# EAGLE schematic C717469 (EAGLE 9.6.2)
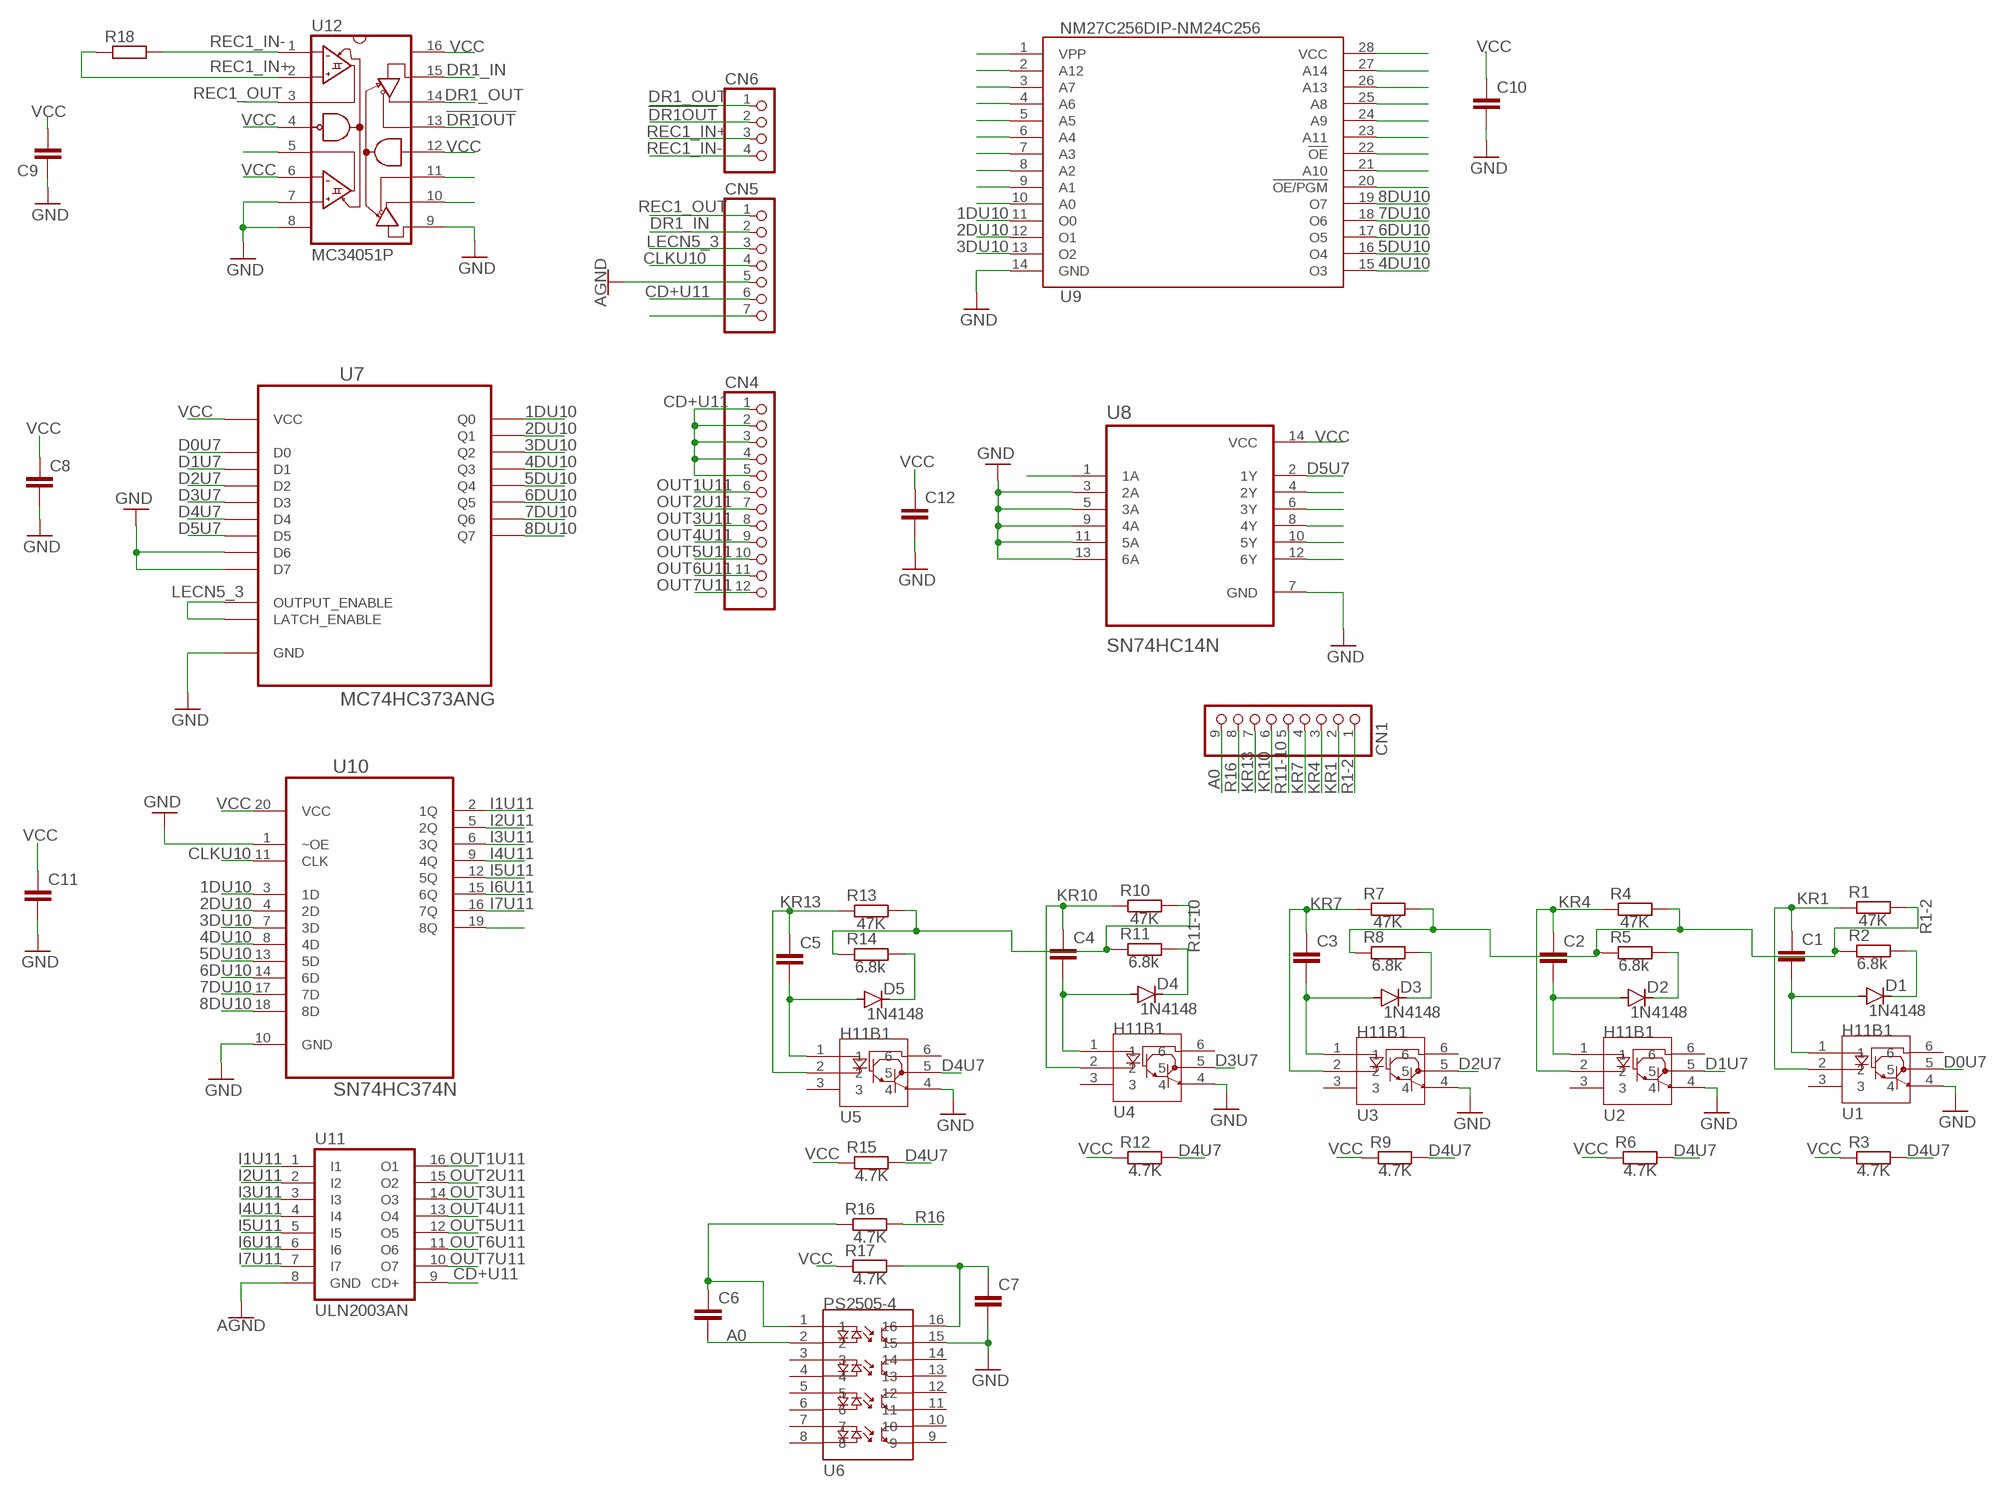
[diagram p0: schematic, sheet 1]

## Parts
C1  C-EU025-025X050  [C025-025X050]
C2  C-EU025-025X050  [C025-025X050]
C3  C-EU025-025X050  [C025-025X050]
C4  C-EU025-025X050  [C025-025X050]
C5  C-EU025-025X050  [C025-025X050]
C6  C-EU025-025X050  [C025-025X050]
C7  C-EU025-025X050  [C025-025X050]
C8  C-EU025-025X050  [C025-025X050]
C9  C-EU025-025X050  [C025-025X050]
C10  C-EU025-025X050  [C025-025X050]
C11  C-EU025-025X050  [C025-025X050]
C12  C-EU025-025X050  [C025-025X050]
CN1  PINHD-1X9  [1X09]
CN4  PINHD-1X12  [1X12]
CN5  PINHD-1X7  [1X07]
CN6  PINHD-1X4  [1X04]
D1  1N4148  1N4148DO35-10  [DO35-10]
D2  1N4148  1N4148DO35-10  [DO35-10]
D3  1N4148  1N4148DO35-10  [DO35-10]
D4  1N4148  1N4148DO35-10  [DO35-10]
D5  1N4148  1N4148DO35-10  [DO35-10]
R1  47K  R-EU_0207/10  [0207/10]
R2  6.8k  R-EU_0207/10  [0207/10]
R3  4.7K  R-EU_0207/10  [0207/10]
R4  47K  R-EU_0207/10  [0207/10]
R5  6.8k  R-EU_0207/10  [0207/10]
R6  4.7K  R-EU_0207/10  [0207/10]
R7  47K  R-EU_0207/10  [0207/10]
R8  6.8k  R-EU_0207/10  [0207/10]
R9  4.7K  R-EU_0207/10  [0207/10]
R10  47K  R-EU_0207/10  [0207/10]
R11  6.8k  R-EU_0207/10  [0207/10]
R12  4.7K  R-EU_0207/10  [0207/10]
R13  47K  R-EU_0207/10  [0207/10]
R14  6.8k  R-EU_0207/10  [0207/10]
R15  4.7K  R-EU_0207/10  [0207/10]
R16  4.7K  R-EU_0207/10  [0207/10]
R17  4.7K  R-EU_0207/10  [0207/10]
R18  R-EU_0207/10  [0207/10]
U1  H11B1  H11B1DIP6  [DIP762W50P254L730H410Q6]
U2  H11B1  H11B1DIP6  [DIP762W50P254L730H410Q6]
U3  H11B1  H11B1DIP6  [DIP762W50P254L730H410Q6]
U4  H11B1  H11B1DIP6  [DIP762W50P254L730H410Q6]
U5  H11B1  H11B1DIP6  [DIP762W50P254L730H410Q6]
U6  PS2505-4  [D16-L]
U7  MC74HC373ANG  [DIP254P762X457-20]
U8  SN74HC14N  [DIP794W45P254L1969H508Q14]
U9  NM27C256DIP-NM24C256  [DIP1499W48P254L3734H572Q28]
U10  SN74HC374N  [DIP254P762X508-20]
U11  ULN2003AN  [DIL16]
U12  MC34051P  [D16]

## Nets
1DU10: U7.2(Q0) U9.11(O0) U10.3(1D)
2DU10: U7.5(Q1) U9.12(O1) U10.4(2D)
3DU10: U7.6(Q2) U9.13(O2) U10.7(3D)
4DU10: U7.9(Q3) U9.15(O3) U10.8(4D)
5DU10: U7.12(Q4) U9.16(O4) U10.13(5D)
6DU10: U7.15(Q5) U9.17(O5) U10.14(6D)
7DU10: U7.16(Q6) U9.18(O6) U10.17(7D)
8DU10: U7.19(Q7) U9.19(O7) U10.18(8D)
!DR1OUT: CN6.2 U12.13(!DR1OUT)
A0: C6.2 CN1.9 U6.2
AGND: CN5.5 U11.8(GND)
CD+U11: CN4.1 CN4.2 CN4.3 CN4.4 CN4.5 CN5.6 U11.9(CD+)
CLKU10: CN5.4 U10.11(CLK)
D0U7: U1.5 U7.3(D0)
D1U7: U2.5 U7.4(D1)
D2U7: U3.5 U7.7(D2)
D3U7: U4.5 U7.8(D3)
D4U7: R3.2 R6.2 R9.2 R12.2 R15.2 U5.5 U7.13(D4)
D5U7: U7.14(D5) U8.2(1Y)
DR1_IN: CN5.2 U12.15(DR1IN)
DR1_OUT: CN6.1 U12.14(DR1OUT)
GND: C7.2 C8.2 C9.1 C10.2 C11.2 C12.2 U1.4 U2.4 U3.4 U4.4 U5.4 U6.15 U7.10(GND) U7.17(D6) U7.18(D7) U8.3(2A) U8.5(3A) U8.7(GND) U8.9(4A) U8.11(5A) U8.13(6A) U9.14(GND) U10.1(~OE) U10.10(GND) U12.7(REC2-IN) U12.8(GND) U12.9(DR2IN)
I1U11: U10.2(1Q) U11.1(I1)
I2U11: U10.5(2Q) U11.2(I2)
I3U11: U10.6(3Q) U11.3(I3)
I4U11: U10.9(4Q) U11.4(I4)
I5U11: U10.12(5Q) U11.5(I5)
I6U11: U10.15(6Q) U11.6(I6)
I7U11: U10.16(7Q) U11.7(I7)
KR1: C1.1 CN1.2 R1.1 U1.2
KR4: C2.1 CN1.3 R4.1 U2.2
KR7: C3.1 CN1.4 R7.1 U3.2
KR10: C4.1 CN1.6 R10.1 U4.2
KR13: C5.1 CN1.7 R13.1 U5.2
LECN5_3: CN5.3 U7.1(OUTPUT_ENABLE) U7.11(LATCH_ENABLE)
N$1: U12.10(DR2OUT)
N$2: U8.1(1A)
N$3: D5.C R14.2
N$4: U12.5(REC2OUT)
N$5: D3.C R8.2
N$6: U12.11(!DR2OUT)
N$7: CN5.7
N$8: C5.2 D5.A U5.1
N$9: U9.28(VCC)
N$10: C6.1 R16.1 U6.1
N$12: D4.C R11.2
N$13: C7.1 R17.2 U6.16
N$14: U8.12(6Y)
N$15: U8.10(5Y)
N$16: U8.8(4Y)
N$17: U8.6(3Y)
N$23: C4.2 D4.A U4.1
N$24: U8.4(2Y)
N$30: U9.20(!OE/PGM)
N$31: U9.22(!OE)
N$32: U9.21(A10)
N$33: U9.24(A9)
N$34: U10.19(8Q)
N$35: U9.23(A11)
N$36: C3.2 D3.A U3.1
N$39: D2.C R5.2
N$41: C2.2 D2.A U2.1
N$43: U9.25(A8)
N$44: U9.26(A13)
N$45: U9.27(A14)
N$46: U9.1(VPP)
N$47: U9.2(A12)
N$48: U9.3(A7)
N$49: U9.4(A6)
N$50: U9.5(A5)
N$51: U9.6(A4)
N$52: U9.7(A3)
N$53: U9.8(A2)
N$54: U9.9(A1)
N$55: U9.10(A0)
N$57: D1.C R2.2
N$59: C1.2 D1.A U1.1
OUT1U11: CN4.6 U11.16(O1)
OUT2U11: CN4.7 U11.15(O2)
OUT3U11: CN4.8 U11.14(O3)
OUT4U11: CN4.9 U11.13(O4)
OUT5U11: CN4.10 U11.12(O5)
OUT6U11: CN4.11 U11.11(O6)
OUT7U11: CN4.12 U11.10(O7)
R1-2: CN1.1 R1.2 R2.1 R4.2 R5.1 R7.2 R8.1
R11-10: CN1.5 R10.2 R11.1 R13.2 R14.1
R16: CN1.8 R16.2
REC1_IN+: CN6.3 R18.1 U12.2(REC1+IN)
REC1_IN-: CN6.4 R18.2 U12.1(REC1-IN)
REC1_OUT: CN5.1 U12.3(REC1OUT)
VCC: C8.1 C9.2 C10.1 C11.1 C12.1 R3.1 R6.1 R9.1 R12.1 R15.1 R17.1 U7.20(VCC) U8.14(VCC) U10.20(VCC) U12.4(!RECEN) U12.6(REC2+IN) U12.12(DREN) U12.16(VCC)
Unconnected: U1.3 U1.6 U2.3 U2.6 U3.3 U3.6 U4.3 U4.6 U5.3 U5.6 U6.3 U6.4 U6.5 U6.6 U6.7 U6.8 U6.9 U6.10 U6.11 U6.12 U6.13 U6.14

## Library data of the parts
C1-C12 = rcl:C-EU: CAPACITOR, European symbol; SPICEPREFIX: C
CN1 = pinhead:PINHD-1X9: PIN HEADER
CN4 = pinhead:PINHD-1X12: PIN HEADER
CN5 = pinhead:PINHD-1X7: PIN HEADER
CN6 = pinhead:PINHD-1X4: PIN HEADER
D1-D5 = diode:1N4148: DIODE high speed (Philips)
R1-R18 = rcl:R-EU_: RESISTOR, European symbol; SPICEPREFIX: R
U1-U5 = Tonche_Library:H11B1
U6 = Tonche_Library:PS2505-4
U7 = MC74HC373ANG:MC74HC373ANG: Octal 3-State Non-Inverting Transparent Latch Check availability <https://pricing.snapeda.com/parts/MC74HC373ANG/ON%20Semiconductor/view-part?ref=eda>; AVAILABILITY: In Stock; CHECK_PRICES: https://www.snapeda.com/parts/MC74HC373ANG/Onsemi/view-part/?ref=eda; DESCRIPTION: Latch Transparent 3-ST 8 Channel D-Type 20-Pin Plastic Dip Rail; MF: ON Semiconductor; MP: MC74HC373ANG; PACKAGE: PDIP-20 ON Semiconductor; PRICE: None; SNAPEDA_LINK: https://www.snapeda.com/parts/MC74HC373ANG/Onsemi/view-part/?ref=snap
U8 = SN74HC14N:SN74HC14N: Check availability <https://pricing.snapeda.com/parts/SN74HC14N/Texas%20Instruments/view-part?ref=eda>; AVAILABILITY: In Stock; CHECK_PRICES: https://www.snapeda.com/parts/SN74HC14N/Texas+Instruments/view-part/?ref=eda; DESCRIPTION: 6-ch, 2-V to 6-V inverters with Schmitt-Trigger inputs; MF: Texas Instruments; MP: SN74HC14N; PACKAGE: PDIP-14 Texas Instruments; PRICE: None; PURCHASE-URL: https://www.snapeda.com/api/url_track_click_mouser/?unipart_id=45696&manufacturer=Texas Instruments&part_name=SN74HC14N&search_term=sn74hc14n; SNAPEDA_LINK: https://www.snapeda.com/parts/SN74HC14N/Texas+Instruments/view-part/?ref=snap
U9 = Tonche_Library:NM27C256
U10 = SN74HC374N:SN74HC374N: OCTAL D-TYPE TRANSPARENT LATCHES AND EDGE-TRIGGERED FLIP-FLOPS Check availability <https://pricing.snapeda.com/parts/SN74HC374N/Texas%20Instruments/view-part?ref=eda>; AVAILABILITY: In Stock; CHECK_PRICES: https://www.snapeda.com/parts/SN74HC374N/Texas+Instruments/view-part/?ref=eda; DESCRIPTION: Octal Edge-Triggered D-Type Flip-Flops With 3-State Outputs; MF: Texas Instruments; MP: SN74HC374N; PACKAGE: PDIP-20 Texas Instruments; PRICE: None; PURCHASE-URL: https://www.snapeda.com/api/url_track_click_mouser/?unipart_id=33120&manufacturer=Texas Instruments&part_name=SN74HC374N&search_term= sn74hc374n; SNAPEDA_LINK: https://www.snapeda.com/parts/SN74HC374N/Texas+Instruments/view-part/?ref=snap
U11 = uln-udn:ULN2003A: DRIVER ARRAY
U12 = Tonche_Library:MC34051P